# EAGLE design M4ToVGA (EAGLE 9.2.1)
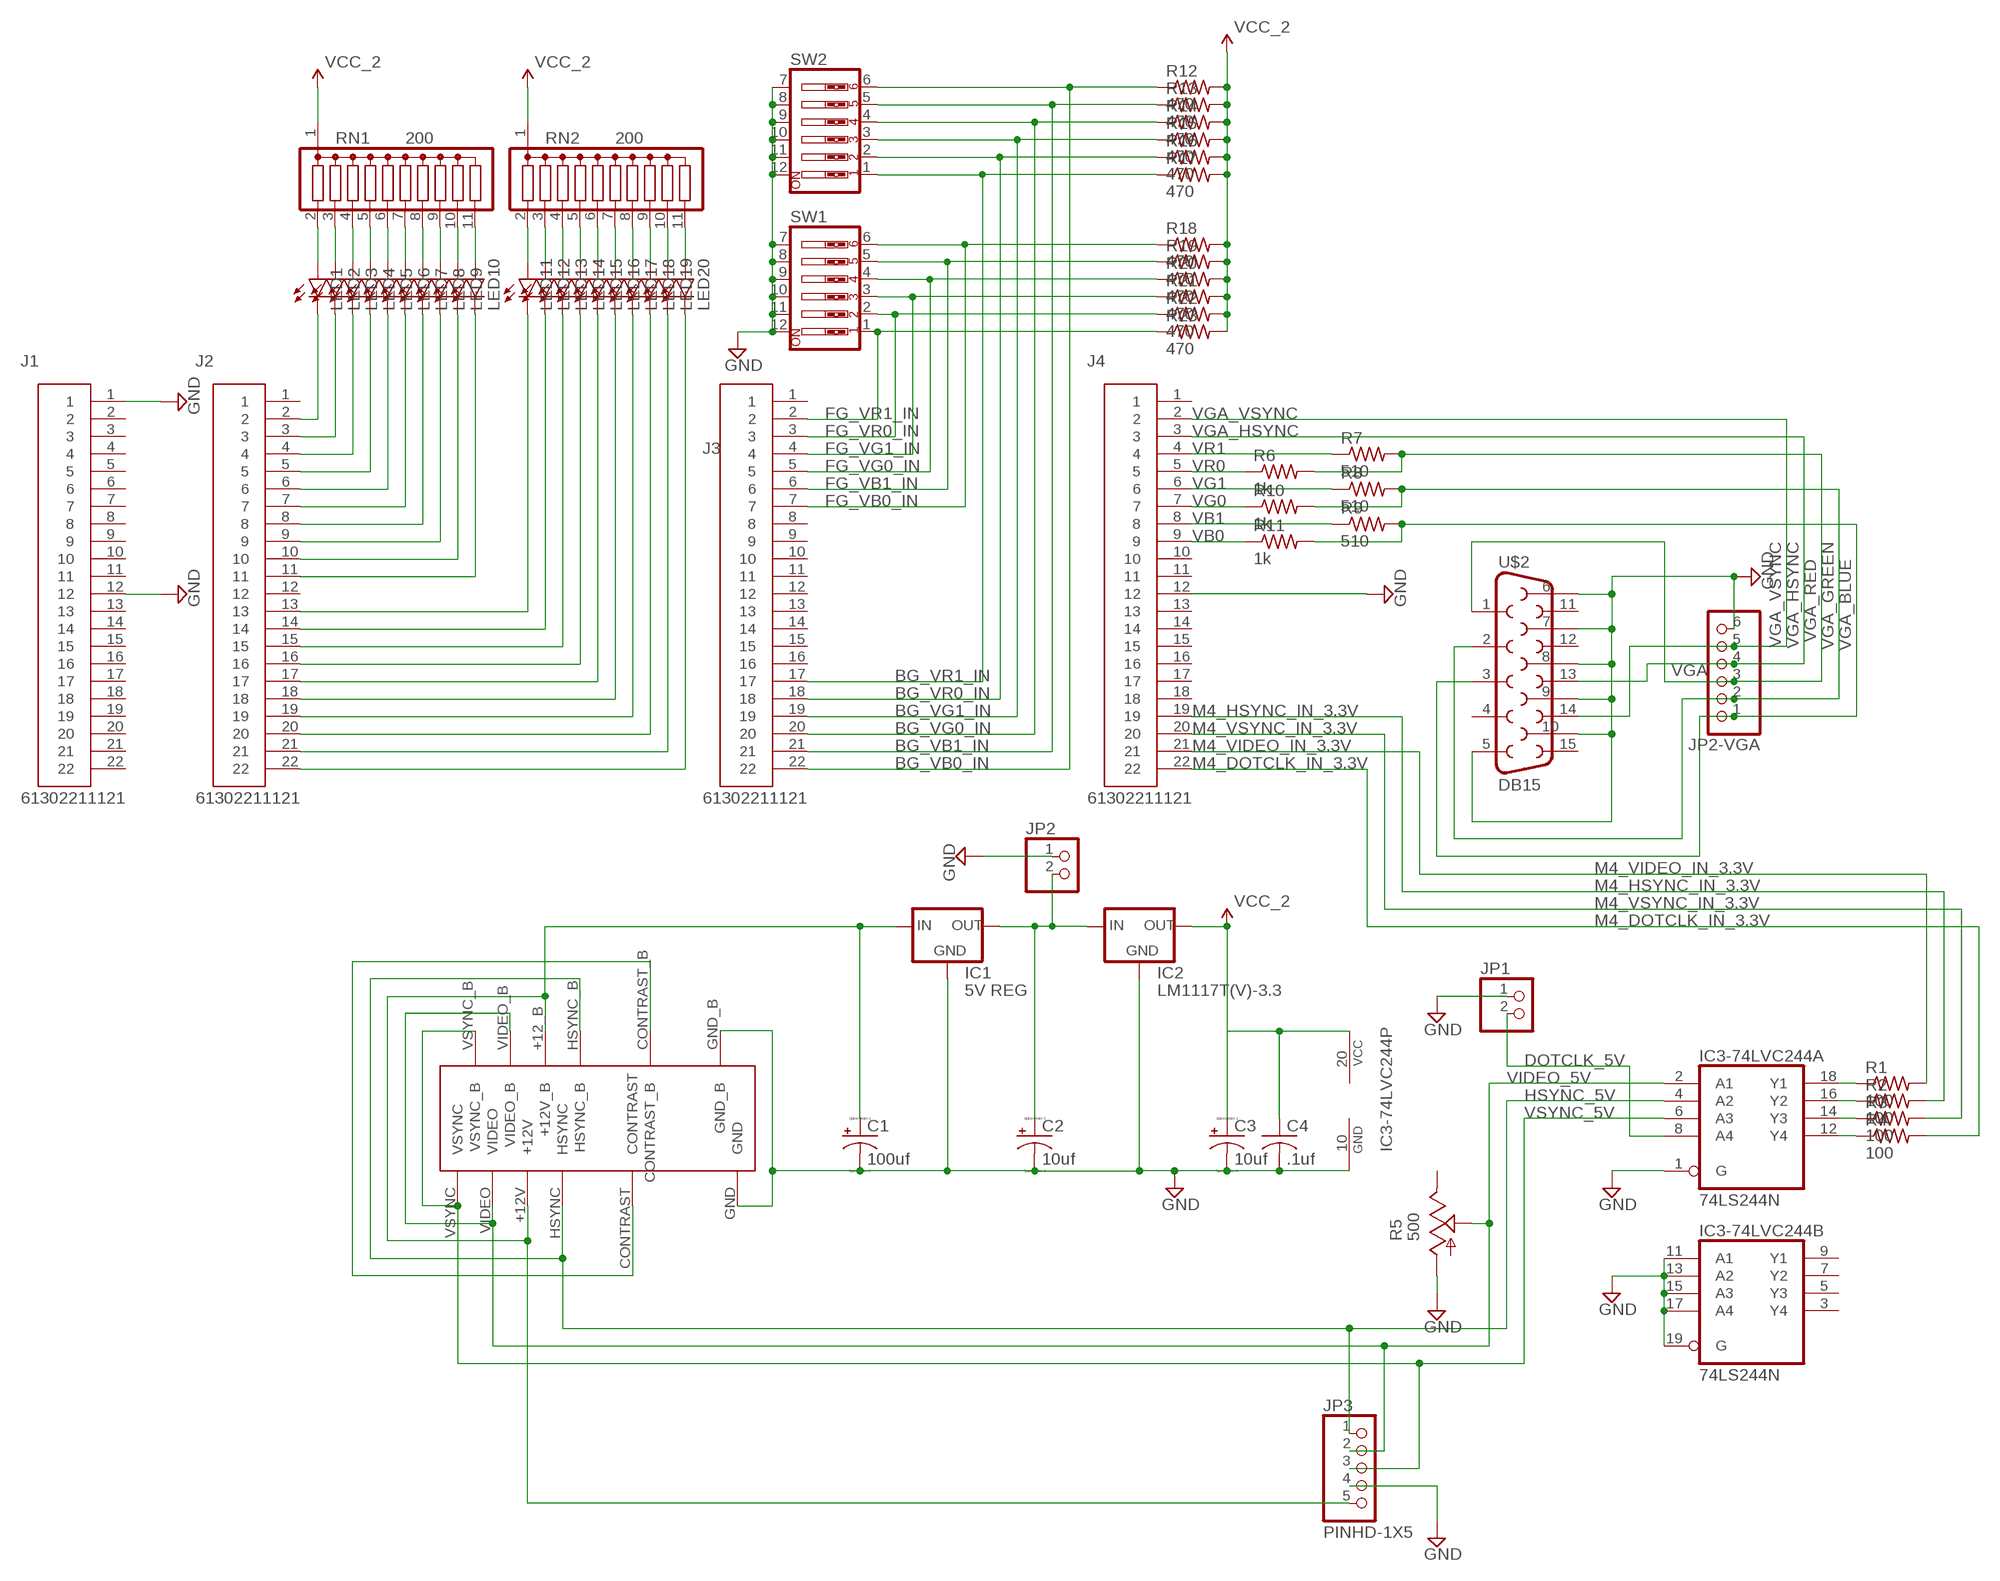
[diagram p0: schematic, sheet 1]

## Parts
C1  100uf  CPOL-USE2.5-5  [E2,5-5]
C2  10uf  CPOL-USE2.5-5  [E2,5-5]
C3  10uf  CPOL-USE2.5-5  [E2,5-5]
C4  .1uf  C-US025-025X050  [C025-025X050]
IC1  5V REG  78XXS  [78XXS]
IC2  LM1117T(V)-3.3  [TO220V]
IC3-74LVC244  74LS244N  [DIL20]
J1  61302211121  [61302211121]
J2  61302211121  [61302211121]
J3  61302211121  [61302211121]
J4  61302211121  [61302211121]
JP1  PINHD-1X2  [1X02]
JP2  PINHD-1X2  [1X02]
JP2-VGA  VGA  PINHD-1X6  [1X06]
JP3  PINHD-1X5  [1X05]
LED1  LED3MM  [LED3MM]
LED2  LED3MM  [LED3MM]
LED3  LED3MM  [LED3MM]
LED4  LED3MM  [LED3MM]
LED5  LED3MM  [LED3MM]
LED6  LED3MM  [LED3MM]
LED7  LED3MM  [LED3MM]
LED8  LED3MM  [LED3MM]
LED9  LED3MM  [LED3MM]
LED10  LED3MM  [LED3MM]
LED11  LED3MM  [LED3MM]
LED12  LED3MM  [LED3MM]
LED13  LED3MM  [LED3MM]
LED14  LED3MM  [LED3MM]
LED15  LED3MM  [LED3MM]
LED16  LED3MM  [LED3MM]
LED17  LED3MM  [LED3MM]
LED18  LED3MM  [LED3MM]
LED19  LED3MM  [LED3MM]
LED20  LED3MM  [LED3MM]
R1  100  R-US_0204/7  [0204/7]
R2  100  R-US_0204/7  [0204/7]
R3  100  R-US_0204/7  [0204/7]
R4  100  R-US_0204/7  [0204/7]
R5  500  TRIM_US-B25P  [B25P]
R6  1k  R-US_0204/7  [0204/7]
R7  510  R-US_0204/7  [0204/7]
R8  510  R-US_0204/7  [0204/7]
R9  510  R-US_0204/7  [0204/7]
R10  1k  R-US_0204/7  [0204/7]
R11  1k  R-US_0204/7  [0204/7]
R12  470  R-US_0204/7  [0204/7]
R13  470  R-US_0204/7  [0204/7]
R14  470  R-US_0204/7  [0204/7]
R15  470  R-US_0204/7  [0204/7]
R16  470  R-US_0204/7  [0204/7]
R17  470  R-US_0204/7  [0204/7]
R18  470  R-US_0204/7  [0204/7]
R19  470  R-US_0204/7  [0204/7]
R20  470  R-US_0204/7  [0204/7]
R21  470  R-US_0204/7  [0204/7]
R22  470  R-US_0204/7  [0204/7]
R23  470  R-US_0204/7  [0204/7]
RN1  200  G10R  [SIL11]
RN2  200  G10R  [SIL11]
SW1  SW_DIP-6  [EDG-06]
SW2  SW_DIP-6  [EDG-06]
U$1  AMP-583479-1-CARD-EDGE  [AMP583479-1]
U$2  DB15  [DB15]

## Nets
+5V: C2.+ IC1.OUT IC2.3(IN) JP2.2
+12V: C1.+ IC1.IN JP3.5 U$1.+12_B(+12V_B) U$1.+12V
BG_VB0_IN: J3.22 R12.1 SW2.6
BG_VB1_IN: J3.21 R13.1 SW2.5
BG_VG0_IN: J3.20 R14.1 SW2.4
BG_VG1_IN: J3.19 R15.1 SW2.3
BG_VR0_IN: J3.18 R16.1 SW2.2
BG_VR1_IN: J3.17 R17.1 SW2.1
DOTCLK_5V: IC3-74LVC244.8(A:A4) JP1.2
FG_VB0_IN: J3.7 R18.1 SW1.6
FG_VB1_IN: J3.6 R19.1 SW1.5
FG_VG0_IN: J3.5 R20.1 SW1.4
FG_VG1_IN: J3.4 R21.1 SW1.3
FG_VR0_IN: J3.3 R22.1 SW1.2
FG_VR1_IN: J3.2 R23.1 SW1.1
GND: C1.- C2.- C3.- C4.2 IC1.GND IC2.1(GND) IC3-74LVC244.1(A:G) IC3-74LVC244.10(P:GND) IC3-74LVC244.11(B:A1) IC3-74LVC244.13(B:A2) IC3-74LVC244.15(B:A3) IC3-74LVC244.17(B:A4) IC3-74LVC244.19(B:G) J1.1 J1.12 J4.12 JP1.1 JP2-VGA.6 JP2.1 JP3.4 R5.A SW1.7 SW1.8 SW1.9 SW1.10 SW1.11 SW1.12 SW2.7 SW2.8 SW2.9 SW2.10 SW2.11 SW2.12 U$1.GND U$1.GND_B U$2.5 U$2.6 U$2.7 U$2.8 U$2.9 U$2.10
HSYNC_5V: IC3-74LVC244.4(A:A2) JP3.1 U$1.HSYNC U$1.HSYNC_B
M4_DOTCLK_IN_3.3V: J4.22 R4.2
M4_HSYNC_IN_3.3V: J4.19 R2.2
M4_VIDEO_IN_3.3V: J4.21 R1.2
M4_VSYNC_IN_3.3V: J4.20 R3.2
N$1: IC3-74LVC244.18(A:Y1) R1.1
N$2: IC3-74LVC244.16(A:Y2) R2.1
N$3: IC3-74LVC244.14(A:Y3) R3.1
N$4: IC3-74LVC244.12(A:Y4) R4.1
N$5: LED1.A RN1.2
N$6: U$1.CONTRAST U$1.CONTRAST_B
N$7: LED2.A RN1.3
N$8: LED3.A RN1.4
N$9: LED4.A RN1.5
N$10: LED5.A RN1.6
N$11: LED6.A RN1.7
N$12: LED7.A RN1.8
N$13: LED8.A RN1.9
N$14: LED9.A RN1.10
N$15: LED10.A RN1.11
N$16: LED11.A RN2.2
N$17: LED12.A RN2.3
N$18: LED13.A RN2.4
N$19: LED14.A RN2.5
N$20: LED15.A RN2.6
N$21: LED16.A RN2.7
N$22: LED17.A RN2.8
N$23: LED18.A RN2.9
N$24: LED19.A RN2.10
N$25: LED20.A RN2.11
OUTPUTLEDA_0: J2.11 LED10.K(C)
OUTPUTLEDA_1: J2.10 LED9.K(C)
OUTPUTLEDA_2: J2.9 LED8.K(C)
OUTPUTLEDA_3: J2.8 LED7.K(C)
OUTPUTLEDA_4: J2.7 LED6.K(C)
OUTPUTLEDA_5: J2.6 LED5.K(C)
OUTPUTLEDA_6: J2.5 LED4.K(C)
OUTPUTLEDA_7: J2.4 LED3.K(C)
OUTPUTLEDA_8: J2.3 LED2.K(C)
OUTPUTLEDA_9: J2.2 LED1.K(C)
OUTPUTLEDB_0: J2.22 LED20.K(C)
OUTPUTLEDB_1: J2.21 LED19.K(C)
OUTPUTLEDB_2: J2.20 LED18.K(C)
OUTPUTLEDB_3: J2.19 LED17.K(C)
OUTPUTLEDB_4: J2.18 LED16.K(C)
OUTPUTLEDB_5: J2.17 LED15.K(C)
OUTPUTLEDB_6: J2.16 LED14.K(C)
OUTPUTLEDB_7: J2.15 LED13.K(C)
OUTPUTLEDB_8: J2.14 LED12.K(C)
OUTPUTLEDB_9: J2.13 LED11.K(C)
VB0: J4.9 R11.1
VB1: J4.8 R9.1
VCC_2: C3.+ C4.1 IC2.2(OUT) IC3-74LVC244.20(P:VCC) R12.2 R13.2 R14.2 R15.2 R16.2 R17.2 R18.2 R19.2 R20.2 R21.2 R22.2 R23.2 RN1.1 RN2.1
VG0: J4.7 R10.1
VG1: J4.6 R8.1
VGA_BLUE: JP2-VGA.1 R9.2 R11.2 U$2.3
VGA_GREEN: JP2-VGA.2 R8.2 R10.2 U$2.2
VGA_HSYNC: J4.3 JP2-VGA.4 U$2.13
VGA_RED: JP2-VGA.3 R6.2 R7.2 U$2.1
VGA_VSYNC: J4.2 JP2-VGA.5 U$2.14
VIDEO_5V: IC3-74LVC244.2(A:A1) JP3.2 R5.S U$1.VIDEO U$1.VIDEO_B
VR0: J4.5 R6.1
VR1: J4.4 R7.1
VSYNC_5V: IC3-74LVC244.6(A:A3) JP3.3 U$1.VSYNC U$1.VSYNC_B
Unconnected: IC3-74LVC244.3(B:Y4) IC3-74LVC244.5(B:Y3) IC3-74LVC244.7(B:Y2) IC3-74LVC244.9(B:Y1) J1.2 J1.3 J1.4 J1.5 J1.6 J1.7 J1.8 J1.9 J1.10 J1.11 J1.13 J1.14 J1.15 J1.16 J1.17 J1.18 J1.19 J1.20 J1.21 J1.22 J2.1 J2.12 J3.1 J3.8 J3.9 J3.10 J3.11 J3.12 J3.13 J3.14 J3.15 J3.16 J4.1 J4.10 J4.11 J4.13 J4.14 J4.15 J4.16 J4.17 J4.18 R5.E U$2.4 U$2.11 U$2.12 U$2.15

## Library data of the parts
C1-C3 = resistor:CPOL-US: POLARIZED CAPACITOR, American symbol
C4 = resistor:C-US: CAPACITOR, American symbol
IC1 = v-reg:78XXS: VOLTAGE REGULATOR
IC2 = lm1117_10:LM1117?-*: 800mA Low-Dropout Linear Regulator Source: http://www.ti.com/lit/ds/symlink/lm1117-n.pdf; MF: Texas Instruments; MPN: LM1117T-3.3; OC_FARNELL: 1469056; OC_NEWARK: 13B5347
IC3-74LVC244 = 74xx-us:74*244: Octal BUFFER and LINE DRIVER, 3-state
J1-J4 = Headers:61302211121: CONN HEADER VERT 22POS 2.54MM Manufacturer's datasheet <https://katalog.we-online.de/em/datasheet/6130xx11121.pdf>; CREATED_BY: PCBLayout.com; DIGIKEY_PART_NUMBER: 732-5330-ND; MANUFACTURER: Wurth Electronics Inc.; MPN: 61302211121
JP1 JP2 = Connector:PINHD-1X2: PIN HEADER; CATEGORY: CONNECTOR; SUB-CATEGORY: PIN-HEADER
JP2-VGA = Connector:PINHD-1X6: PIN HEADER; CATEGORY: CONNECTOR; SUB-CATEGORY: PIN-HEADER
JP3 = Connector:PINHD-1X5: PIN HEADER; CATEGORY: CONNECTOR; SUB-CATEGORY: PIN-HEADER
LED1-LED20 = led:LED: LED OSRAM: - CHIPLED LG R971, LG N971, LY N971, LG Q971, LY Q971, LO R971, LY R971 LH N974, LH R974 LS Q976, LO Q976, LY Q976 LO Q996 - Hyper CHIPLED LW Q18S LB Q993, LB Q99A, LB R99A - SideLED LS A670, LO A670, LY A670, LG A670, LP A670 LB A673, LV A673, LT A673, LW A673 LH A674 LY A675 LS A676, LA A676, LO A676, LY A676, LW A676 LS A679, LY A679, LG A679 - Hyper Micro SIDELED® LS Y876, LA Y876, LO Y876, LY Y876 LT Y87S - SmartLED LW L88C, LW L88S LB L89C, LB L89S, LG L890 LS L89K, LO L89K, LY L89K LS L896, LA L896, LO L896, LY L896 - TOPLED LS T670, LO T670, LY T670, LG T670, LP T670 LSG T670, LSP T670, LSY T670, LOP T670, LYG T670 LG T671, LOG T671, LSG T671 LB T673, LV T673, LT T673, LW T673 LH T674 LS T676, LA T676, LO T676, LY T676, LB T676, LH T676, LSB T676, LW T676 LB T67C, LV T67C, LT T67C, LS T67K, LO T67K, LY T67K, LW E67C LS E67B, LA E67B, LO E67B, LY E67B, LB E67C, LV E67C, LT E67C LW T67C LS T679, LY T679, LG T679 LS T770, LO T770, LY T770, LG T770, LP T770 LB T773, LV T773, LT T773, LW T773 LH T774 LS E675, LA E675, LY E675, LS T675 LS T776, LA T776, LO T776, LY T776, LB T776 LHGB T686 LT T68C, LB T68C - Hyper Mini TOPLED® LB M676 - Mini TOPLED Santana® LG M470 LS M47K, LO M47K, LY M47K Source: http://www.osram.convergy.de LUXEON: - LUMILED® LXK2-PW12-R00, LXK2-PW12-S00, LXK2-PW14-U00, LXK2-PW14-V00 LXK2-PM12-R00, LXK2-PM12-S00, LXK2-PM14-U00 LXK2-PE12-Q00, LXK2-PE12-R00, LXK2-PE12-S00, LXK2-PE14-T00, LXK2-PE14-U00 LXK2-PB12-K00, LXK2-PB12-L00, LXK2-PB12-M00, LXK2-PB14-N00, LXK2-PB14-P00, LXK2-PB14-Q00 LXK2-PR12-L00, LXK2-PR12-M00, LXK2-PR14-Q00, LXK2-PR14-R00 LXK2-PD12-Q00, LXK2-PD12-R00, LXK2-PD12-S00 LXK2-PH12-R00, LXK2-PH12-S00 LXK2-PL12-P00, LXK2-PL12-Q00, LXK2-PL12-R00 Source: www.luxeon.com KINGBRIGHT: KA-3528ASYC Source: www.kingbright.com
R1-R4 R6-R23 = resistor:R-US_: RESISTOR, American symbol
R5 = pot:TRIM_US-: POTENTIOMETER
RN1 RN2 = resistor-sil:G10R: SIL RESISTOR; OC_FARNELL: unknown; OC_NEWARK: unknown
SW1 SW2 = special:SW_DIP-6: DIP SWITCH
U$1 = cpld:AMP-583479-1-CARD-EDGE: AMP 583479-1 CARD EDGE
U$2 = SparkFun-Retired:DB15: DB15 / VGA right angle through-hole female connector.

## Board
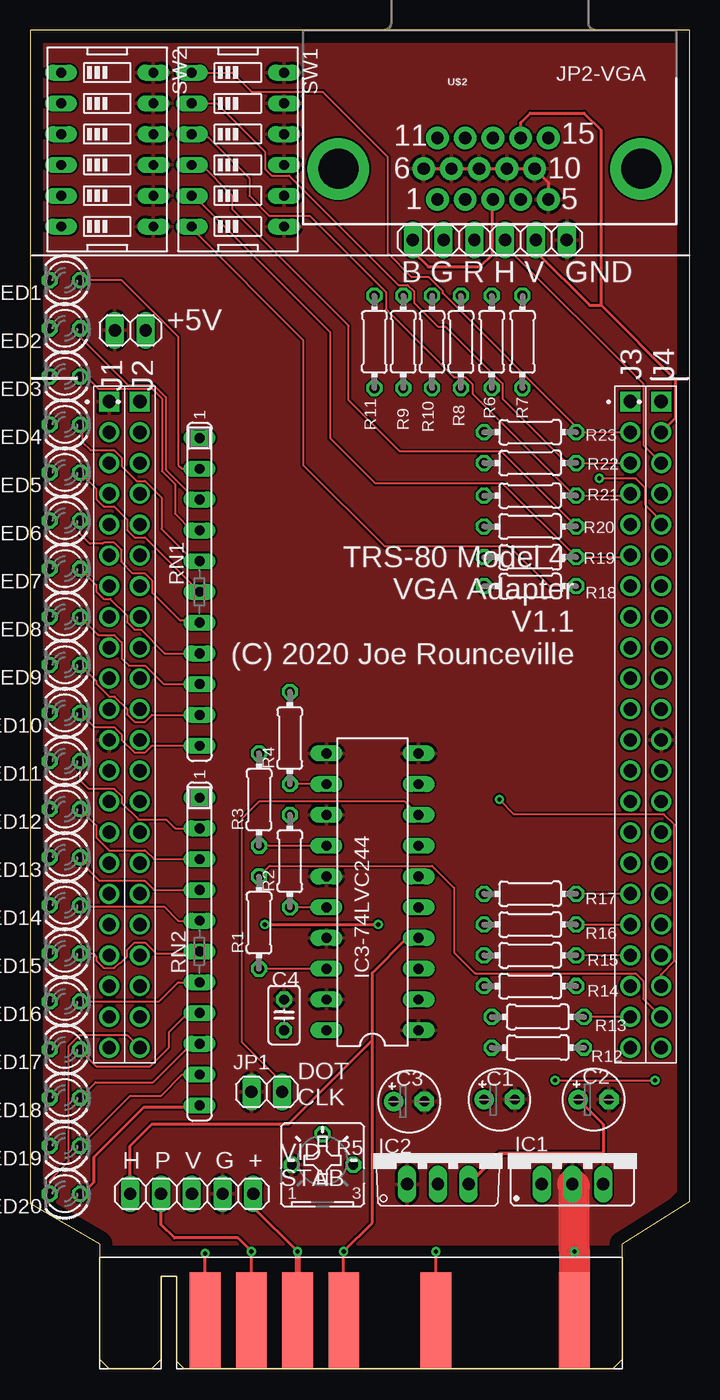
[diagram p1: board, top side]
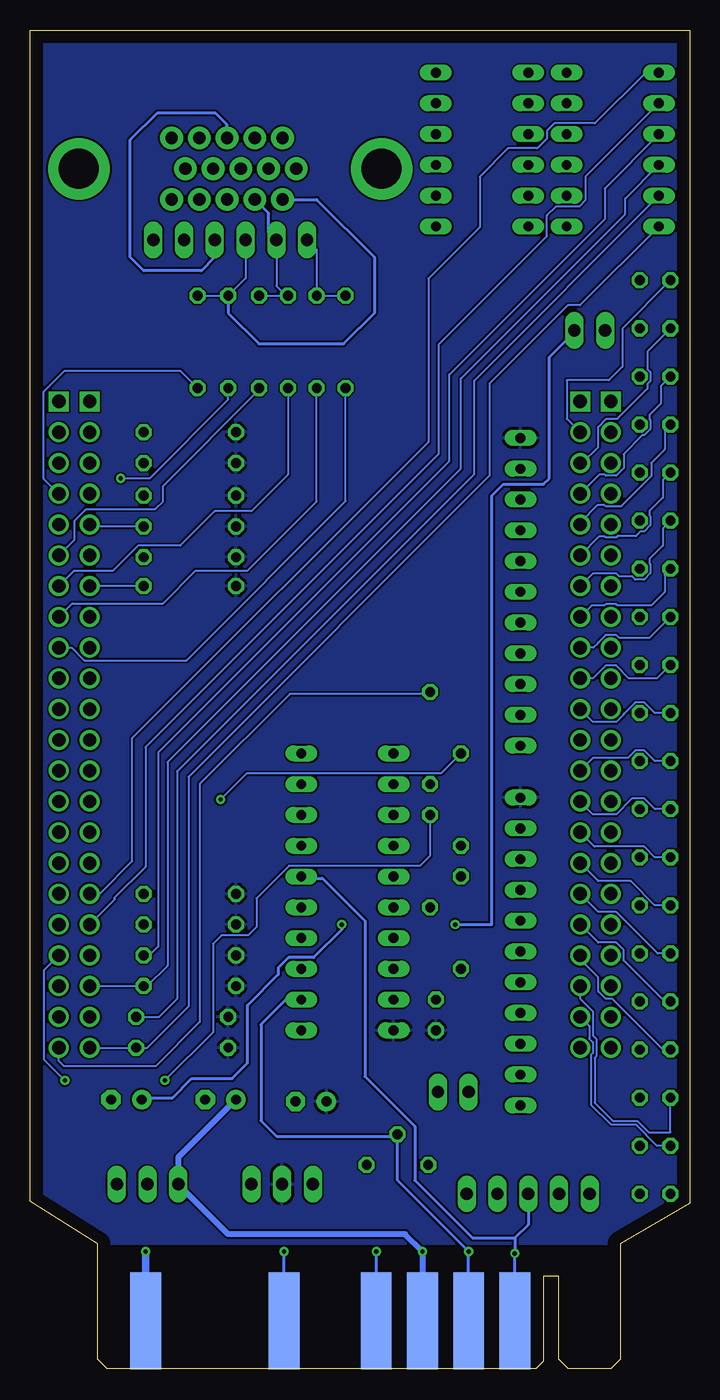
[diagram p2: board, bottom side, seen from below]

Size 54.45 x 110.49 mm. Coordinates in mm from the lower left corner, seen from the top.
Outline: 0,109.21 0,13.65
Outline: 0,13.65 5.71,10.32 5.71,0.79 6.51,0 10,0 10.79,0.79 10.79,7.62 12.06,7.62 12.06,0.64 12.7,0 48.1,0 48.89,0.79 48.89,10.32 54.45,13.81 54.45,110.49 0,110.49 0,13.65
Copper layers (1*16): Top 0.035mm / dielectric 1.5mm / Bottom 0.035mm
Design rules "default": minimum track width 6mil, minimum drill 0.35mm, track to track 6mil, track to pad 6mil, pad to pad 6mil, via to via 6mil, smd to smd 6mil, copper to edge 40mil, drill to drill 6mil, minimum pad ring 10mil, minimum via ring 8mil, stop-mask expansion 4mil, vias tented up to drill 0mil, thermal gap 10mil

### Footprints (pad centres in the part's own frame; a part is rotated, then mirrored left to right if it is on the bottom)
E2,5-5 = drill 0.813 pad 1.6: + -1.27,0 | drill 0.813 pad 1.6 octagon: - 1.27,0
C025-025X050 = drill 0.813 octagon: 1 -1.27,0; 2 1.27,0
78XXS = drill 1.016 long: GND 0,-2.54; IN -2.54,-2.54; OUT 2.54,-2.54
TO220V = drill 1.016 long: 1 -2.54,-2.54; 2 0,-2.54; 3 2.54,-2.54
DIL20 = drill 0.813 long: 1 -11.43,-3.81; 2 -8.89,-3.81; 3 -6.35,-3.81; 4 -3.81,-3.81; 5 -1.27,-3.81; 6 1.27,-3.81; 7 3.81,-3.81; 8 6.35,-3.81; 9 8.89,-3.81; 10 11.43,-3.81; 11 11.43,3.81; 12 8.89,3.81; 13 6.35,3.81; 14 3.81,3.81; 15 1.27,3.81; 16 -1.27,3.81; 17 -3.81,3.81; 18 -6.35,3.81; 19 -8.89,3.81; 20 -11.43,3.81
61302211121 = drill 1.1 square: 1 -26.67,0 | drill 1.1: 2 -24.13,0; 3 -21.59,0; 4 -19.05,0; 5 -16.51,0; 6 -13.97,0; 7 -11.43,0; 8 -8.89,0; 9 -6.35,0; 10 -3.81,0; 11 -1.27,0; 12 1.27,0; 13 3.81,0; 14 6.35,0; 15 8.89,0; 16 11.43,0; 17 13.97,0; 18 16.51,0; 19 19.05,0; 20 21.59,0; 21 24.13,0; 22 26.67,0
1X02 = drill 1.016 long: 1 -1.27,0; 2 1.27,0
1X06 = drill 1.016 long: 1 -6.35,0; 2 -3.81,0; 3 -1.27,0; 4 1.27,0; 5 3.81,0; 6 6.35,0
1X05 = drill 1.016 long: 1 -5.08,0; 2 -2.54,0; 3 0,0; 4 2.54,0; 5 5.08,0
LED3MM = drill 0.813 octagon: A -1.27,0; K 1.27,0
0204/7 = drill 0.813 octagon: 1 -3.81,0; 2 3.81,0
B25P = drill 0.813 octagon: A -2.54,0; E 2.54,0; S 0,2.54
SIL11 = drill 0.813 long: 1 -12.7,0; 2 -10.16,0; 3 -7.62,0; 4 -5.08,0; 5 -2.54,0; 6 0,0; 7 2.54,0; 8 5.08,0; 9 7.62,0; 10 10.16,0; 11 12.7,0
EDG-06 = drill 0.813 long: 1 -6.35,-3.81; 2 -3.81,-3.81; 3 -1.27,-3.81; 4 1.27,-3.81; 5 3.81,-3.81; 6 6.35,-3.81; 7 6.35,3.81; 8 3.81,3.81; 9 1.27,3.81; 10 -1.27,3.81; 11 -3.81,3.81; 12 -6.35,3.81
AMP583479-1 = smd 2.54 x 8 bottom: +12_B 16.351,3.969; CONTRAST_B 27.781,3.969; GND_B 39.211,3.969; HSYNC_B 20.161,3.969; VIDEO_B 12.541,3.969; VSYNC_B 8.731,3.969 | smd 2.54 x 8: +12V 16.351,3.969; CONTRAST 27.781,3.969; GND 39.211,3.969; HSYNC 20.161,3.969; VIDEO 12.541,3.969; VSYNC 8.731,3.969
DB15 = drill 1.016 pad 1.88: 1 -4.32,-7.62; 2 -2.03,-7.62; 3 0.26,-7.62; 4 2.55,-7.62; 5 4.84,-7.62; 6 -5.46,-5.08; 7 -3.17,-5.08; 8 -0.88,-5.08; 9 1.41,-5.08; 10 3.7,-5.08; 11 -4.32,-2.54; 12 -2.03,-2.54; 13 0.26,-2.54; 14 2.55,-2.54; 15 4.84,-2.54 | drill 3.302 pad 5.08: G1 -12.5,-5.08; G2 12.5,-5.08

### Placement (x,y rotation side)
C1  38.73,22.22 0 top
C2  46.51,22.22 0 top
C3  31.27,22.07 0 top
C4  20.95,29.21 90 top
IC1  44.77,17.78 0 top
IC2  33.66,17.78 0 top
IC3-74LVC244  28.26,39.37 90 top
J1  6.51,53.18 270 top
J2  9.05,53.18 270 top
J3  49.55,53.18 270 top
J4  52.09,53.18 270 top
JP1  19.53,22.86 0 top
JP2  8.25,85.73 0 top
JP2-VGA  37.94,93.19 0 top
JP3  13.33,14.45 0 top
LED1  2.86,89.85 180 top
LED2  2.86,85.88 180 top
LED3  2.86,81.92 180 top
LED4  2.86,77.95 180 top
LED5  2.86,73.98 180 top
LED6  2.86,70.01 180 top
LED7  2.86,66.04 180 top
LED8  2.86,62.07 180 top
LED9  2.86,58.1 180 top
LED10  2.86,54.13 180 top
LED11  2.86,50.16 180 top
LED12  2.86,46.2 180 top
LED13  2.86,42.23 180 top
LED14  2.86,38.26 180 top
LED15  2.86,34.29 180 top
LED16  2.86,30.32 180 top
LED17  2.86,26.35 180 top
LED18  2.86,22.38 180 top
LED19  2.86,18.41 180 top
LED20  2.86,14.45 180 top
R1  18.89,36.83 90 top
R2  21.43,41.91 90 top
R3  18.89,46.99 90 top
R4  21.43,52.07 90 top
R5  24.13,16.83 0 top
R6  38.1,84.77 90 top
R7  40.64,84.77 90 top
R8  35.56,84.77 90 top
R9  30.8,84.77 90 top
R10  33.18,84.77 90 top
R11  28.42,84.77 90 top
R12  41.91,26.51 180 top
R13  41.91,29.05 180 top
R14  41.27,31.59 180 top
R15  41.27,34.13 180 top
R16  41.27,36.67 180 top
R17  41.27,39.21 180 top
R18  41.27,64.61 180 top
R19  41.27,66.99 180 top
R20  41.27,69.53 180 top
R21  41.27,72.07 180 top
R22  41.27,74.77 180 top
R23  41.27,77.31 180 top
RN1  13.97,64.14 270 top
RN2  13.97,34.45 270 top
SW1  17.14,100.65 270 top
SW2  6.35,100.65 270 top
U$1  5.71,0 0 top
U$2  37.94,104.14 0 top

### Tracks (layer width: path | path; a pad name or v marks a point on that pad's centre or on a via)
+5V  (via drill 0.35)
  Top 0.254: C2.+ 47.31,20.16 47.31,17.78 | v19.37,36.67 v28.73,36.67
  Top 0.305: IC1.OUT 47.31,17.78 38.73,17.78 IC2.3
  Bottom 0.254: C2.+ 45.08,22.38 42.7,22.38 41.12,23.97 37.78,23.97 36.51,25.24 36.51,30 33.97,32.54 33.97,33.1 33.12,33.96 31.04,33.96 28.72,36.28 28.72,36.66 v28.73,36.67 | v19.37,36.67 16.35,36.67 16.35,72.07 15.4,73.03 12.06,73.03 11.59,73.5 11.59,83.5 9.52,85.57 JP2.2
+12V  (via drill 0.35)
  Top 0.254: 22.07,4.45 U$1.+12_B | v22.07,9.68 18.41,13.34 JP3.5
  Top 0.508: v22.07,9.68 22.07,4.45
  Bottom 0.254: 22.07,4.45 U$1.+12_B
  Bottom 0.508: C1.+ 42.23,17.46 IC1.IN 38.1,11.11 23.49,11.11 v22.07,9.68 22.07,4.45
BG_VB0_IN
  Bottom 0.152: J3.22 R12.1 44.78,26.51 41.39,29.9 41.39,48.87 16.54,73.73 16.54,81.31 10.06,87.78 9.05,87.78 SW2.6
BG_VB1_IN
  Top 0.152: J3.21 R13.1
  Bottom 0.152: R13.1 43.83,29.05 42.33,30.55 42.33,49.32 17.79,73.85 17.79,81.59 SW2.5
BG_VG0_IN
  Bottom 0.152: J3.20 R14.1 44.78,31.59 43.11,33.26 43.11,50.08 18.89,74.3 18.89,81.76 5.32,95.33 5.32,96.6 SW2.4
BG_VG1_IN
  Top 0.152: J3.19 R15.1
  Bottom 0.152: SW2.3 7.02,97.43 7.02,94.88 9.45,92.46 9.46,92.46 19.84,82.07 19.84,74.93 43.89,50.88 43.89,34.86 44.62,34.13 R15.1
BG_VR0_IN
  Top 0.152: R16.1 J3.18
  Bottom 0.152: SW2.2 8.61,98.39 8.61,96.47 9.13,95.95 11.05,95.95 11.79,95.21 11.79,93.5 20.74,84.55 20.74,75.51 44.93,51.32 44.93,41.43 47.47,38.89 47.47,38.75 J3.18
BG_VR1_IN
  Top 0.152: J3.17 R17.1
  Bottom 0.152: SW2.1 3.64,107 7.83,102.81 11.19,102.81 11.79,102.21 11.79,101.55 12.59,100.74 15,100.74 17.34,98.4 17.34,94.25 21.59,90 21.59,76.52 46.04,52.07 46.04,41.91 48.74,39.21 J3.17
DOTCLK_5V
  Top 0.152: IC3-74LVC244.8 30.96,46.83 18.89,46.83 17.46,45.4 17.46,26.99 20.8,23.65 JP1.2
FG_VB0_IN
  Top 0.152: SW1.6 13.33,94.14 22.54,84.93 22.54,74.61 29.27,67.88 39.58,67.88 42.85,64.61 R18.1
  Bottom 0.152: R18.1 J3.7
FG_VB1_IN
  Top 0.152: J3.6 49.39,66.99 R19.1 38.99,73.09 28.51,73.09 24.76,76.84 24.76,85.57 13.49,96.84 SW1.5
FG_VG0_IN
  Top 0.152: SW1.4 14.13,99.38 16.67,96.84 16.67,95.73 26.29,86.11 26.29,79.95 30.51,75.72 38.89,75.72 R20.1
  Bottom 0.152: R20.1 49.39,69.53 J3.5
FG_VG1_IN
  Top 0.152: J3.4 49.39,72.07 R21.1 44.93,72.07 36.51,80.49 36.51,81.27 35.93,81.85 34.99,81.85 29.37,87.47 29.37,88.89 23.07,95.19 19.74,95.19 18.1,96.83 18.1,98.27 14.45,101.92 SW1.3
FG_VR0_IN
  Top 0.152: SW1.2 15.4,104.46 19.41,100.45 19.41,99.01 19.93,98.49 21.37,98.49 30.38,89.47 31.17,89.47 31.69,88.95 31.69,88.01 33.65,86.04 34.28,86.04 38.99,81.33 38.99,80.07 44.29,74.77 R22.1 J3.3
FG_VR1_IN
  Top 0.152: J3.2 R23.1 45.02,77.38 45.02,77.84 34.07,88.79 34.07,88.95 32.91,90.11 31.5,90.11 29.53,92.08 29.53,100.01 24.13,105.41 18.26,105.41 16.67,107 SW1.1
GND  (via drill 0.35)
  Top 0.254: U$2.6 U$2.7 U$2.8 U$2.9 U$2.10 42.78,97.92 U$2.5
  Top 0.305: v44.93,9.68 44.77,9.84
  Top 2.54: IC1.GND 44.93,15.08 v44.93,9.68 U$1.GND_B
  Bottom 0.254: 44.93,7.62 U$1.GND_B
  Bottom 0.61: v44.93,9.68 44.93,7.62
  pour Top: 5.71,10.32 48.9,10.32 54.61,16.03 54.61,110.49 0,110.49 0,16.03
HSYNC_5V  (via drill 0.35)
  Top 0.254: U$1.HSYNC v25.88,9.68 28.26,12.07 28.26,27.15 | 28.26,27.15 21.33,20.22 10.05,20.22 8.25,18.43 JP3.1 | 28.26,27.15 28.26,32.7 31.11,35.56 IC3-74LVC244.4
  Bottom 0.254: U$1.HSYNC v25.88,9.68
M4_DOTCLK_IN_3.3V
  Bottom 0.152: R4.2 21.59,55.72 33.02,55.72 40.45,48.29 40.45,28.62 44.08,24.99 51.66,24.99 52.09,25.42 J4.22
M4_HSYNC_IN_3.3V  (via drill 0.35)
  Top 0.152: v43.34,23.81 v51.59,23.81
  Bottom 0.152: R2.2 21.47,45.68 21.47,42.34 22.28,41.53 33.1,41.53 35.78,38.84 35.78,36.46 36.46,35.78 38.67,35.78 39.37,35.08 39.37,27.78 v43.34,23.81 | J4.19 53.32,32.9 53.32,25.54 v51.59,23.81
M4_VIDEO_IN_3.3V
  Top 0.152: J4.21 50.6,30.54 50.6,32.03 49.98,32.65 36.73,32.65 35,34.37 35,39.71 33.18,41.53 19.77,41.53 R1.2
M4_VSYNC_IN_3.3V  (via drill 0.35)
  Top 0.152: J4.20 52.09,32.56 53.18,33.66 53.18,44.93 52.33,45.78 39.95,45.78 v38.73,46.99
  Bottom 0.152: R3.2 20.54,49.15 36.58,49.15 v38.73,46.99
N$1
  Top 0.152: IC3-74LVC244.18 R1.1
N$2
  Top 0.152: IC3-74LVC244.16 R2.1
N$3
  Top 0.152: IC3-74LVC244.14 R3.1
N$4
  Top 0.152: IC3-74LVC244.12 R4.1
N$5
  Top 0.152: RN1.2 12.54,74.3 12.22,74.61 12.22,85.19 7.55,89.86 LED1.A
N$6  (via drill 0.35)
  Top 0.254: U$1.CONTRAST_B v33.5,9.68
  Bottom 0.254: U$1.CONTRAST_B v33.5,9.68
N$7
  Top 0.152: LED2.A 4.09,85.85 4.09,85.19 8.07,81.21 10.18,81.21 11.18,80.22 11.18,74.22 13.65,71.76 RN1.3
N$8
  Top 0.152: RN1.4 13.32,69.22 11.94,70.59 11.94,73.03 10.87,74.1 10.87,80.09 10.06,80.91 5.61,80.91 4.6,81.92 LED3.A
N$9
  Top 0.152: RN1.5 13.48,66.68 10.83,69.32 10.83,71.94 9.48,73.29 8.79,73.29 7.56,74.51 7.56,75.21 6.94,75.83 4.98,75.83 4.29,76.52 4.29,77.79 LED4.A
N$10
  Top 0.152: LED5.A 5.45,72.65 5.45,71.8 6.07,71.18 6.93,71.18 7.99,70.11 7.99,69.26 8.61,68.64 9.47,68.64 RN1.6
N$11
  Top 0.152: RN1.7 13.81,61.75 12.38,61.75 10.1,64.03 10.1,65.05 9.48,65.67 8.47,65.67 7.49,66.64 7.56,66.72 7.56,67.59 6.94,68.21 6.07,68.21 5.97,68.1 4.92,68.1 4.13,68.9 LED6.A
N$12
  Top 0.152: RN1.8 11.11,59.06 9.15,61.02 8.61,61.02 7.99,61.64 7.99,62.17 6.61,63.56 6.07,63.56 5.45,64.18 5.45,64.71 LED7.A
N$13
  Top 0.152: LED8.A 5.61,60.59 6.94,60.59 7.56,59.97 7.56,58.64 8.15,58.05 9.48,58.05 11.01,56.52 RN1.9
N$14
  Top 0.152: LED9.A 5.45,56.78 5.45,56.56 6.5,55.51 6.94,55.51 7.99,54.46 7.99,54.02 8.61,53.4 9.48,53.4 10.06,53.98 RN1.10
N$15
  Top 0.152: RN1.11 10.06,51.44 9.48,50.86 8.61,50.86 7.56,51.91 7.56,52.35 6.94,52.97 5.3,52.97 LED10.A
N$16
  Top 0.152: RN2.2 11.97,44.61 11.23,45.35 8.95,45.35 7.56,46.73 7.56,47.27 6.94,47.89 4.82,47.89 4.13,48.58 LED11.A
N$17
  Top 0.152: LED12.A 5.45,44.87 5.45,43.86 6.5,42.81 9.48,42.81 10.22,42.07 RN2.3
N$18
  Top 0.152: LED13.A 4.76,41.59 4.76,41.22 5.71,40.27 9.48,40.27 10.22,39.53 RN2.4
N$19
  Top 0.152: RN2.5 12.22,36.99 11.05,38.16 4.13,38.16 LED14.A
N$20
  Top 0.152: RN2.6 13.81,34.29 10.48,34.29 10.38,34.29 9.48,35.19 8.61,35.19 7.99,34.57 7.99,34.03 7.46,33.5 7.36,33.5 6.94,33.08 6.07,33.08 5.45,33.7 5.45,34.01 5.18,34.29 LED15.A
N$21
  Top 0.152: LED16.A 10.64,30.32 12.22,31.91 RN2.7
N$22
  Top 0.152: LED17.A 4.13,26.29 5.44,24.98 9.9,24.98 11.43,26.51 11.43,27.78 13.02,29.37 RN2.8
N$23
  Top 0.152: LED18.A 5.4,23.65 10.16,23.65 13.33,26.83 RN2.9
N$24
  Top 0.152: LED19.A 8.25,22.54 10.79,22.54 12.54,24.29 RN2.10
N$25
  Top 0.254: RN2.11 13.81,21.59 9.37,21.59 5.24,17.46 5.24,15.4 4.29,14.45 LED20.A
OUTPUTLEDA_0
  Bottom 0.152: LED10.K 2.87,54.13 3.76,55.02 4.5,55.02 5.45,54.06 5.45,54.02 6.07,53.4 7.99,53.4 J2.11
OUTPUTLEDA_1
  Bottom 0.152: LED9.K 2.7,56.99 5.02,56.99 6.07,58.05 6.94,58.05 8,56.99 J2.10
OUTPUTLEDA_2
  Bottom 0.152: LED8.K 3.33,60.33 5.81,60.33 6.07,60.59 6.94,60.59 7.56,59.97 7.56,59.91 7.94,59.53 J2.9
OUTPUTLEDA_3
  Bottom 0.152: LED7.K 2.06,65.56 2.06,64.14 3.17,63.02 5.97,63.02 6.07,63.13 6.94,63.13 7.05,63.02 8.1,63.02 J2.8
OUTPUTLEDA_4
  Bottom 0.152: LED6.K 2.22,69.37 2.22,67.95 3.33,66.83 3.33,66.5 3.24,66.41 3.24,65.67 3.76,65.15 4.5,65.15 4.75,65.41 5.81,65.41 6.07,65.67 7.99,65.67 J2.7
OUTPUTLEDA_5
  Bottom 0.152: LED5.K 2.22,73.34 2.22,71.91 3.33,70.8 3.33,70.47 3.24,70.38 3.24,69.64 3.76,69.12 4.06,69.12 4.44,68.74 5.97,68.74 6.07,68.64 6.94,68.64 7.02,68.71 7.49,68.71 J2.6
OUTPUTLEDA_6
  Bottom 0.152: LED4.K 2.06,77.47 2.06,75.88 3.17,74.77 3.17,73.67 5.67,71.18 6.94,71.18 7.05,71.28 7.62,71.28 9.05,69.85 J2.5
OUTPUTLEDA_7
  Bottom 0.152: LED3.K 2.38,81.12 2.38,79.69 3.33,78.74 3.33,78.41 3.24,78.31 3.24,77.58 3.76,77.06 3.9,77.06 5.45,75.51 5.45,74.34 6.07,73.72 6.94,73.72 7.05,73.82 7.46,73.82 J2.4
OUTPUTLEDA_8
  Bottom 0.152: LED2.K 3.49,83.98 3.49,82.54 3.24,82.28 3.24,81.55 3.49,81.29 3.49,80.89 5.96,78.42 6.89,78.42 7.56,77.75 7.56,76.1 8.89,74.77 J2.3
OUTPUTLEDA_9
  Bottom 0.152: LED1.K 5.56,85.88 5.56,82.71 6.67,81.6 10.16,81.6 10.16,78.42 J2.2
OUTPUTLEDB_0
  Top 0.152: LED20.K 1.59,15.56 3.17,17.15 3.17,26.67 4.07,27.57 7.99,27.57 J2.22
OUTPUTLEDB_1
  Bottom 0.152: LED19.K 2.7,18.42 4.44,20.16 6.51,20.16 8.14,21.8 8.14,25.93 7.99,26.08 7.99,26.95 8.3,27.26 8.3,28.3 J2.21
OUTPUTLEDB_2
  Bottom 0.152: J2.20 9.05,30.54 7.99,29.49 7.99,27.52 7.69,27.22 7.69,25.81 7.84,25.66 7.84,21.97 6.34,20.47 4.32,20.47 3.38,19.53 1.59,19.53 LED18.K
OUTPUTLEDB_3
  Bottom 0.152: J2.19 9.05,33.81 7.56,32.33 7.56,31.16 6.94,30.54 6.41,30.54 2.22,26.35 LED17.K
OUTPUTLEDB_4
  Bottom 0.152: LED16.K 2.06,30.32 5.45,33.71 5.45,34.57 6.07,35.19 7.56,35.19 J2.18
OUTPUTLEDB_5
  Bottom 0.152: J2.17 7.56,37.73 6.07,37.73 2.64,34.29 LED15.K
OUTPUTLEDB_6
  Bottom 0.152: LED14.K 2.87,38.26 4.88,40.27 7.56,40.27 J2.16
OUTPUTLEDB_7
  Bottom 0.152: LED13.K 2.87,42.23 3.76,43.12 7.87,43.12 J2.15
OUTPUTLEDB_8
  Bottom 0.152: LED12.K 2.87,46.2 3.76,47.09 4.76,47.09 6.07,45.78 7.99,45.78 J2.14
OUTPUTLEDB_9
  Bottom 0.152: LED11.K 2.87,50.17 3.76,51.05 4.5,51.05 5.12,50.43 7.99,50.43 J2.13
VB0
  Bottom 0.152: J4.9 51.04,59.53 49.98,58.48 41.55,58.48 28.42,71.61 R11.1
VB1
  Bottom 0.152: J4.8 50.98,63.18 43.5,63.18 40.8,65.88 36.51,65.88 30.8,71.6 R9.1
VCC_2
  pour Bottom: 0,13.65 5.71,10.32 48.9,10.32 54.45,13.81 54.45,110.49 0,110.49
VG0
  Bottom 0.152: J4.7 50.82,65.88 47.62,65.88 45.56,67.95 42.07,67.95 39.21,70.8 36.19,70.8 33.18,73.82 R10.1
VG1
  Bottom 0.152: J4.6 50.8,68.44 50.8,70.01 49.85,70.96 44.13,70.96 43.5,71.6 43.5,72.87 35.72,80.65 35.72,80.8 R8.1
VGA_BLUE
  Top 0.254: JP2-VGA.1 31.59,92.23 32.86,90.96 37.15,90.96 38.17,91.99 38.17,96.49 U$2.3
  Bottom 0.152: R11.2 R9.2 30.8,92.39 JP2-VGA.1
VGA_GREEN
  Bottom 0.152: R8.2 33.34,88.58 | 33.34,88.58 R10.2 | JP2-VGA.2 34.13,89.38 33.34,88.58
  Bottom 0.254: JP2-VGA.2 34.77,93.82 34.77,95.38 U$2.2
VGA_HSYNC
  Top 0.152: J4.3 50.64,76.22 50.64,81.28 39.21,92.71 JP2-VGA.4
  Bottom 0.254: U$2.13 38.2,102.71 39.15,103.66 43.97,103.66 46.2,101.44 46.2,91.76 45.08,90.65 40.32,90.65 39.21,91.76 JP2-VGA.4
VGA_RED
  Bottom 0.152: R7.2 R6.2 36.67,90.01 JP2-VGA.3
  Bottom 0.254: U$2.1 30.8,96.52 26.03,91.76 26.03,87.15 28.57,84.61 35.56,84.61 38.1,87.15 R6.2
VGA_VSYNC
  Top 0.254: U$2.14 40.49,102.88 41.27,103.66 45.72,103.66 47.15,102.24 47.15,87.79 | JP2-VGA.5 41.75,92.23 46.2,87.79 47.15,87.79 | 47.15,87.79 53.27,81.67 53.27,78.49 J4.2
VIDEO_5V  (via drill 0.35)
  Top 0.254: U$1.VIDEO v18.26,9.68 17.14,10.8 11.91,10.8 10.79,11.91 JP3.2
  Bottom 0.254: U$1.VIDEO v18.26,9.68 24.13,15.56 R5.S 24.13,19.21 34.13,19.21 35.4,20.48 35.4,28.42 33.34,30.48 IC3-74LVC244.2
VR0  (via drill 0.35)
  Top 0.152: J4.5 52.09,69.99 50.8,71.28 50.8,72.71 50.01,73.5 v46.99,73.5
  Bottom 0.152: R6.1 38.1,80.01 44.61,73.5 v46.99,73.5
VR1
  Bottom 0.152: J4.4 53.32,73.46 53.32,80.66 51.59,82.39 42.07,82.39 R7.1
VSYNC_5V  (via drill 0.35)
  Top 0.254: U$1.VSYNC_B v14.45,9.53
  Bottom 0.254: U$1.VSYNC_B v14.45,9.53 14.45,10.8 | JP3.3 13.33,11.91 14.45,10.8 | IC3-74LVC244.6 31.91,40.48 30.32,40.48 26.83,36.99 26.83,24.13 22.7,20 22.7,15.56 17.94,10.8 14.45,10.8

### Text on the board
tPlace: 11 | 15 | 6 | 10 | 1 | 5 | B G R | H V | GND | +5V | TRS-80 Model 4 / VGA Adapter / V1.1 / (C) 2020 Joe Rounceville | DOT / CLK | VID / STAB
tNames: H P V G +